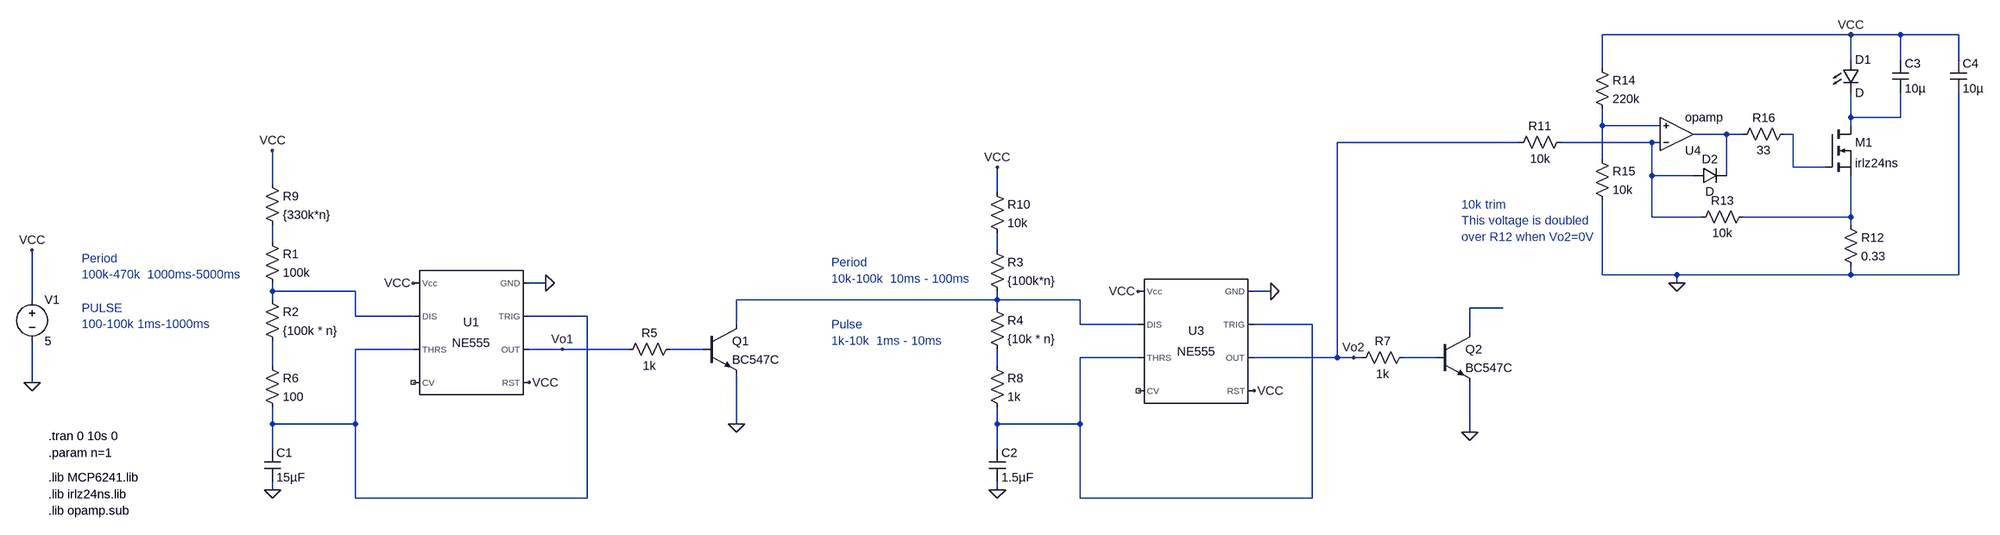
[diagram p0: schematic Led-timer.asc]
Led-timer.asc, the LTspice schematic file:
Version 4
SHEET 1 2920 692
WIRE 2656 -448 2176 -448
WIRE 2752 -448 2656 -448
WIRE 2864 -448 2752 -448
WIRE 2656 -400 2656 -448
WIRE 2752 -400 2752 -448
WIRE 2864 -400 2864 -448
WIRE 2176 -384 2176 -448
WIRE 2656 -288 2656 -336
WIRE 2752 -288 2752 -336
WIRE 2752 -288 2656 -288
WIRE 2176 -272 2176 -304
WIRE 2288 -272 2176 -272
WIRE 2656 -272 2656 -288
WIRE 2416 -256 2352 -256
WIRE 2448 -256 2416 -256
WIRE 2544 -256 2528 -256
WIRE 2016 -240 1664 -240
WIRE 2272 -240 2096 -240
WIRE 2288 -240 2272 -240
WIRE 2176 -208 2176 -272
WIRE 2544 -192 2544 -256
WIRE 2608 -192 2544 -192
WIRE 2272 -176 2272 -240
WIRE 2352 -176 2272 -176
WIRE 2416 -176 2416 -256
WIRE -400 -160 -400 -224
WIRE 1008 -144 1008 -192
WIRE 2272 -96 2272 -176
WIRE 2368 -96 2272 -96
WIRE 2656 -96 2656 -176
WIRE 2656 -96 2448 -96
WIRE 2656 -80 2656 -96
WIRE -400 -48 -400 -80
WIRE 1008 -32 1008 -64
WIRE 2176 16 2176 -128
WIRE 2320 16 2176 16
WIRE 2656 16 2656 0
WIRE 2656 16 2320 16
WIRE 2864 16 2864 -336
WIRE 2864 16 2656 16
WIRE 128 32 96 32
WIRE 2320 32 2320 16
WIRE -400 48 -400 32
WIRE -240 48 -400 48
WIRE 1536 48 1504 48
WIRE -864 64 -864 -32
WIRE -400 64 -400 48
WIRE 1008 64 1008 48
WIRE 1008 64 496 64
WIRE 1168 64 1008 64
WIRE 1008 80 1008 64
WIRE 1984 80 1920 80
WIRE -240 96 -240 48
WIRE -128 96 -240 96
WIRE 208 96 96 96
WIRE 496 112 496 64
WIRE 1168 112 1168 64
WIRE 1280 112 1168 112
WIRE 1616 112 1504 112
WIRE 1920 128 1920 80
WIRE -128 160 -240 160
WIRE 160 160 96 160
WIRE 288 160 160 160
WIRE 432 160 368 160
WIRE 1280 176 1168 176
WIRE 1664 176 1664 -240
WIRE 1664 176 1504 176
WIRE 1696 176 1664 176
WIRE 1712 176 1696 176
WIRE 1856 176 1792 176
WIRE -400 192 -400 144
WIRE 1008 192 1008 160
WIRE -864 224 -864 144
WIRE -400 304 -400 272
WIRE -240 304 -240 160
WIRE -240 304 -400 304
WIRE 496 304 496 208
WIRE 1008 304 1008 272
WIRE 1168 304 1168 176
WIRE 1168 304 1008 304
WIRE 1920 320 1920 224
WIRE -400 352 -400 304
WIRE 1008 352 1008 304
WIRE -400 432 -400 416
WIRE 1008 432 1008 416
WIRE -240 448 -240 304
WIRE 208 448 208 96
WIRE 208 448 -240 448
WIRE 1168 448 1168 304
WIRE 1616 448 1616 112
WIRE 1616 448 1168 448
FLAG -864 224 0
FLAG -864 -32 VCC
FLAG -128 32 VCC
FLAG 128 32 0
FLAG 96 224 VCC
FLAG -400 432 0
FLAG 1280 48 VCC
FLAG 1536 48 0
FLAG 1504 240 VCC
FLAG 1008 432 0
FLAG 496 304 0
FLAG -400 -224 VCC
FLAG 1008 -192 VCC
FLAG 1696 176 Vo2
FLAG 160 160 Vo1
FLAG 1920 320 0
FLAG 2320 32 0
FLAG 2656 -448 VCC
SYMBOL Misc\\NE555 -16 128 M0
SYMATTR InstName U1
SYMBOL res -416 -64 R0
SYMATTR InstName R1
SYMATTR Value 100k
SYMBOL res -416 48 R0
SYMATTR InstName R2
SYMATTR Value {100k * n}
SYMBOL cap -416 352 R0
SYMATTR InstName C1
SYMATTR Value 15µF
SYMBOL voltage -864 48 R0
WINDOW 123 0 0 Left 0
WINDOW 39 0 0 Left 0
SYMATTR InstName V1
SYMATTR Value 5
SYMBOL Misc\\NE555 1392 144 M0
SYMATTR InstName U3
SYMBOL res 992 -48 R0
SYMATTR InstName R3
SYMATTR Value {100k*n}
SYMBOL res 992 64 R0
SYMATTR InstName R4
SYMATTR Value {10k * n}
SYMBOL cap 992 352 R0
SYMATTR InstName C2
SYMATTR Value 1.5µF
SYMBOL npn 432 112 R0
SYMATTR InstName Q1
SYMATTR Value BC547C
SYMBOL res 384 144 R90
WINDOW 0 0 56 VBottom 2
WINDOW 3 32 56 VTop 2
SYMATTR InstName R5
SYMATTR Value 1k
SYMBOL npn 1856 128 R0
SYMATTR InstName Q2
SYMATTR Value BC547C
SYMBOL res 1808 160 R90
WINDOW 0 0 56 VBottom 2
WINDOW 3 32 56 VTop 2
SYMATTR InstName R7
SYMATTR Value 1k
SYMBOL res -416 176 R0
SYMATTR InstName R6
SYMATTR Value 100
SYMBOL res 992 176 R0
SYMATTR InstName R8
SYMATTR Value 1k
SYMBOL res -416 -176 R0
SYMATTR InstName R9
SYMATTR Value {330k*n}
SYMBOL res 992 -160 R0
SYMATTR InstName R10
SYMATTR Value 10k
SYMBOL nmos 2608 -272 R0
SYMATTR InstName M1
SYMATTR Value irlz24ns
SYMATTR Prefix X
SYMBOL res 2640 -96 R0
SYMATTR InstName R12
SYMATTR Value 0.33
SYMBOL LED 2640 -400 R0
SYMATTR InstName D1
SYMBOL OpAmps\\opamp 2320 -192 M180
SYMATTR InstName U4
SYMATTR SpiceLine2 GBW=500k
SYMBOL res 2112 -256 R90
WINDOW 0 0 56 VBottom 2
WINDOW 3 32 56 VTop 2
SYMATTR InstName R11
SYMATTR Value 10k
SYMBOL res 2464 -112 R90
WINDOW 0 0 56 VBottom 2
WINDOW 3 32 56 VTop 2
SYMATTR InstName R13
SYMATTR Value 10k
SYMBOL res 2160 -400 R0
SYMATTR InstName R14
SYMATTR Value 220k
SYMBOL res 2160 -224 R0
SYMATTR InstName R15
SYMATTR Value 10k
SYMBOL diode 2352 -160 R270
WINDOW 0 32 32 VTop 2
WINDOW 3 0 32 VBottom 2
SYMATTR InstName D2
SYMBOL cap 2736 -400 R0
SYMATTR InstName C3
SYMATTR Value 10µ
SYMBOL cap 2848 -400 R0
SYMATTR InstName C4
SYMATTR Value 10µ
SYMBOL res 2544 -272 R90
WINDOW 0 0 56 VBottom 2
WINDOW 3 32 56 VTop 2
SYMATTR InstName R16
SYMATTR Value 33
TEXT -832 328 Left 2 !.tran 0 10s 0
TEXT -768 80 Left 2 ;PULSE\n100-100k 1ms-1000ms
TEXT -768 -16 Left 2 ;Period\n100k-470k  1000ms-5000ms
TEXT 688 112 Left 2 ;Pulse\n1k-10k  1ms - 10ms
TEXT 688 -8 Left 2 ;Period\n10k-100k  10ms - 100ms
TEXT -832 360 Left 2 !.param n=1
TEXT -832 408 Left 2 !.lib MCP6241.lib
TEXT -832 440 Left 2 !.lib irlz24ns.lib
TEXT -832 472 Left 2 !.lib opamp.sub
TEXT 1904 -120 Left 2 ;10k trim\nThis voltage is doubled \nover R12 when Vo2=0V

The netlist it stands for:
* Led-timer.asc
XU1 0 N012 Vo1 VCC NC_01 N012 N009 VCC NE555  ; pins GND TRIG OUT RST CV THRS DIS Vcc
R1 N007 N009 100k
R2 N009 N016 {100k * n}
C1 N012 0 15µF
V1 VCC 0 5
XU3 0 N013 Vo2 VCC NC_02 N013 N010 VCC NE555  ; pins GND TRIG OUT RST CV THRS DIS Vcc
R3 N008 N010 {100k*n}
R4 N010 N017 {10k * n}
C2 N013 0 1.5µF
Q1 N010 N014 0 0 BC547C
R5 N014 Vo1 1k
Q2 N011 N015 0 0 BC547C
R7 N015 Vo2 1k
R6 N016 N012 100
R8 N017 N013 1k
R9 VCC N007 {330k*n}
R10 VCC N008 10k
XM1 N001 N004 N006 irlz24ns  ; pins D G S
R12 N006 0 0.33
D1 VCC N001 D
XU4 N005 N002 N003 opamp Aol=100K GBW=500k  ; pins invin noninvin out
R11 N005 Vo2 10k
R13 N006 N005 10k
R14 VCC N002 220k
R15 N002 0 10k
D2 N005 N003 D
C3 VCC N001 10µ
C4 VCC 0 10µ
R16 N004 N003 33
.model D D
.lib standard.dio
.model NPN NPN
.model PNP PNP
.lib standard.bjt
.tran 0 10s 0
* PULSE
* 100-100k 1ms-1000ms
* Period
* 100k-470k  1000ms-5000ms
* Pulse
* 1k-10k  1ms - 10ms
* Period
* 10k-100k  10ms - 100ms
.param n=1
.lib MCP6241.lib
.lib irlz24ns.lib
.lib opamp.sub
* 10k trim
* This voltage is doubled
* over R12 when Vo2=0V
.lib NE555.sub
.backanno
.end